# EAGLE design LightLabBackPanel (EAGLE 7.6.0)
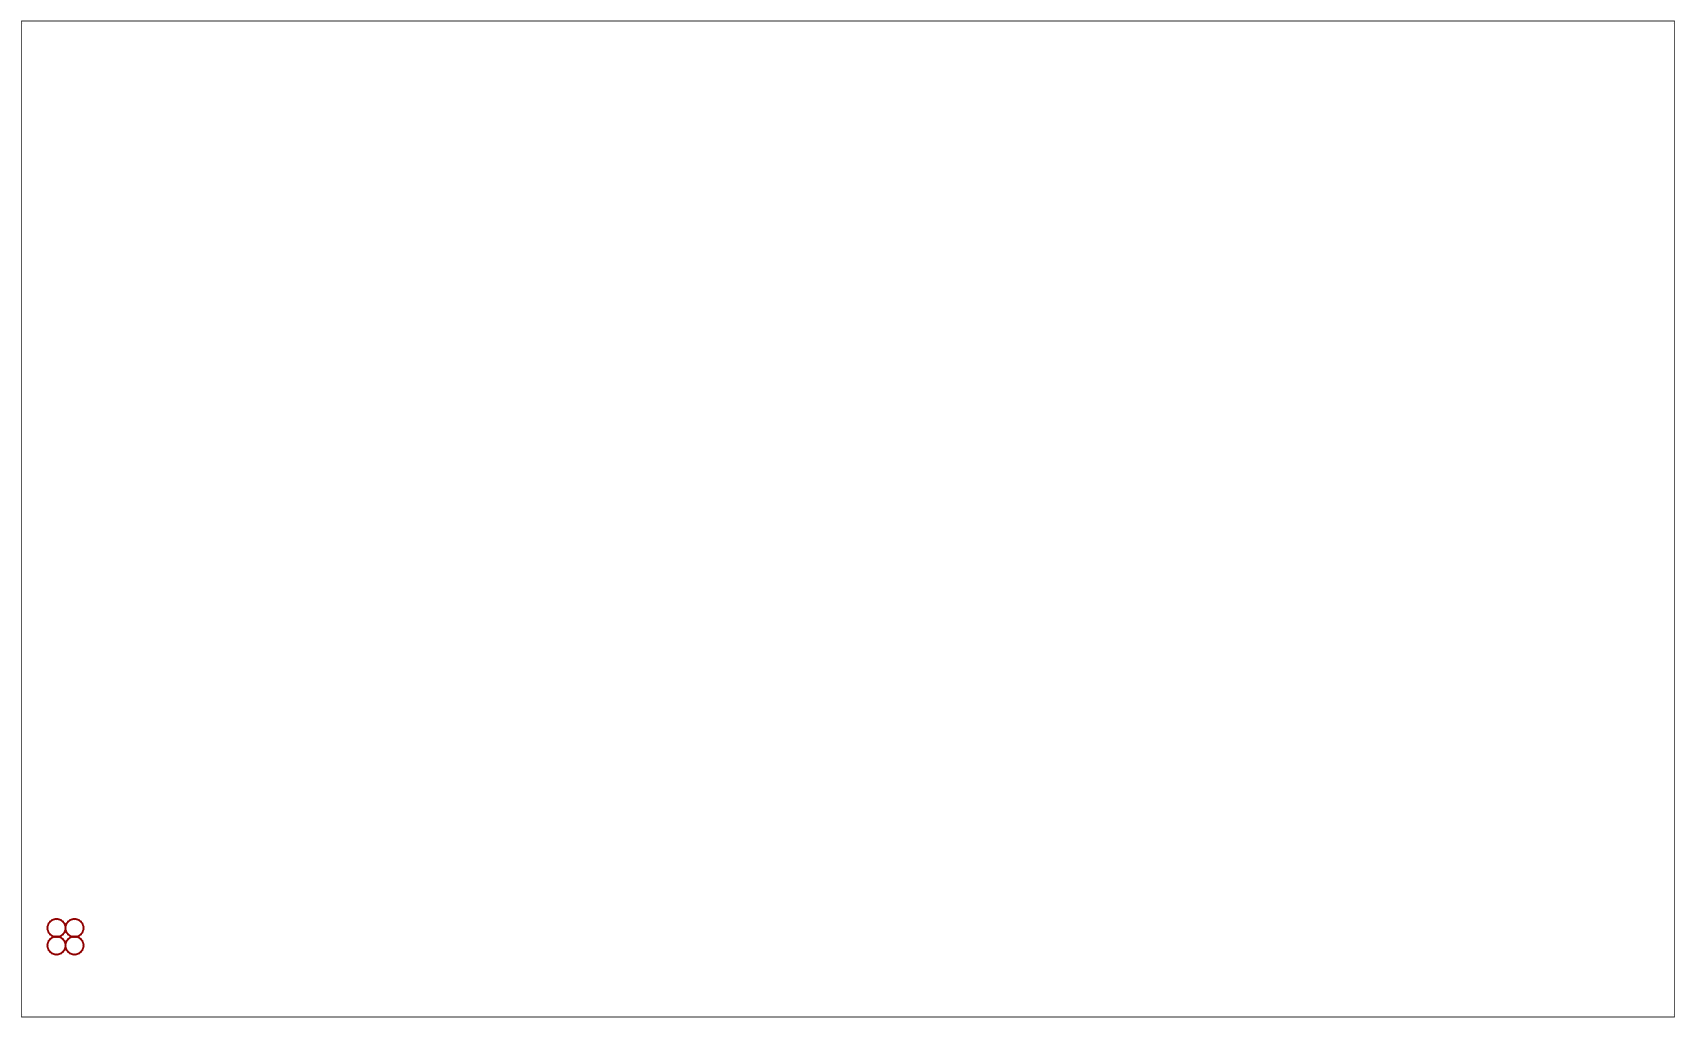
[diagram p0: schematic, sheet 1]

## Parts
JP11  STAND-OFF  [STAND-OFF]
JP13  STAND-OFF  [STAND-OFF]
JP14  STAND-OFF  [STAND-OFF]
JP15  STAND-OFF  [STAND-OFF]

## Library data of the parts
JP11 JP13-JP15 = SparkFun:STAND-OFF: Stand Off This is the mechanical footprint for a #4 phillips button head screw. Use the keepout ring to avoid running the screw head into surrounding components. SKU : PRT-00447

## Net classes
1 power: width 1.626 mm, clearance 0.406 mm

## Board
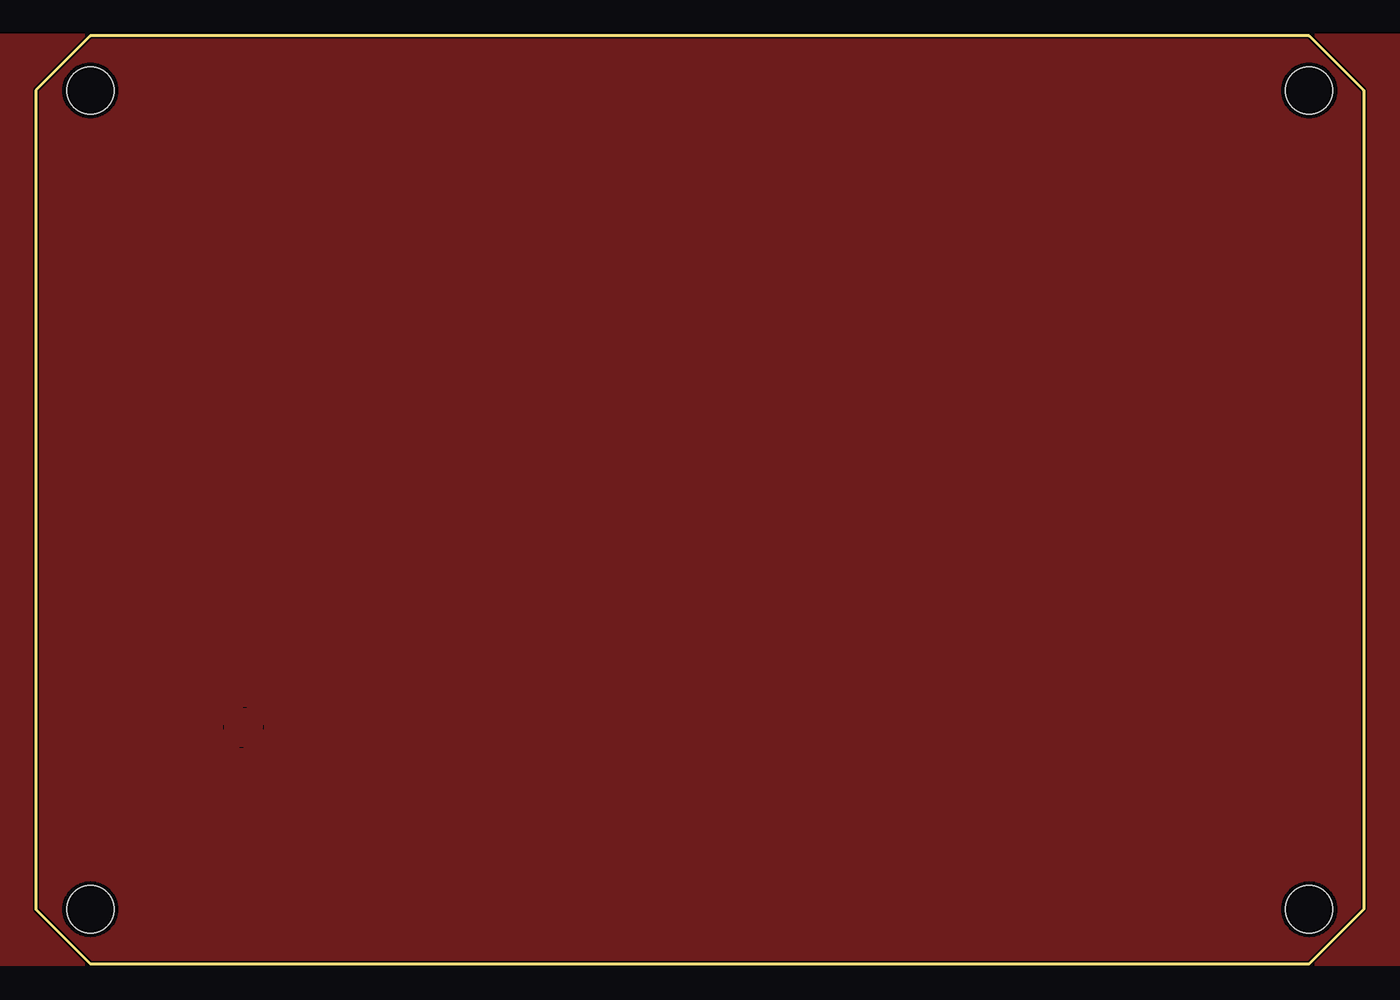
[diagram p1: board, top side]
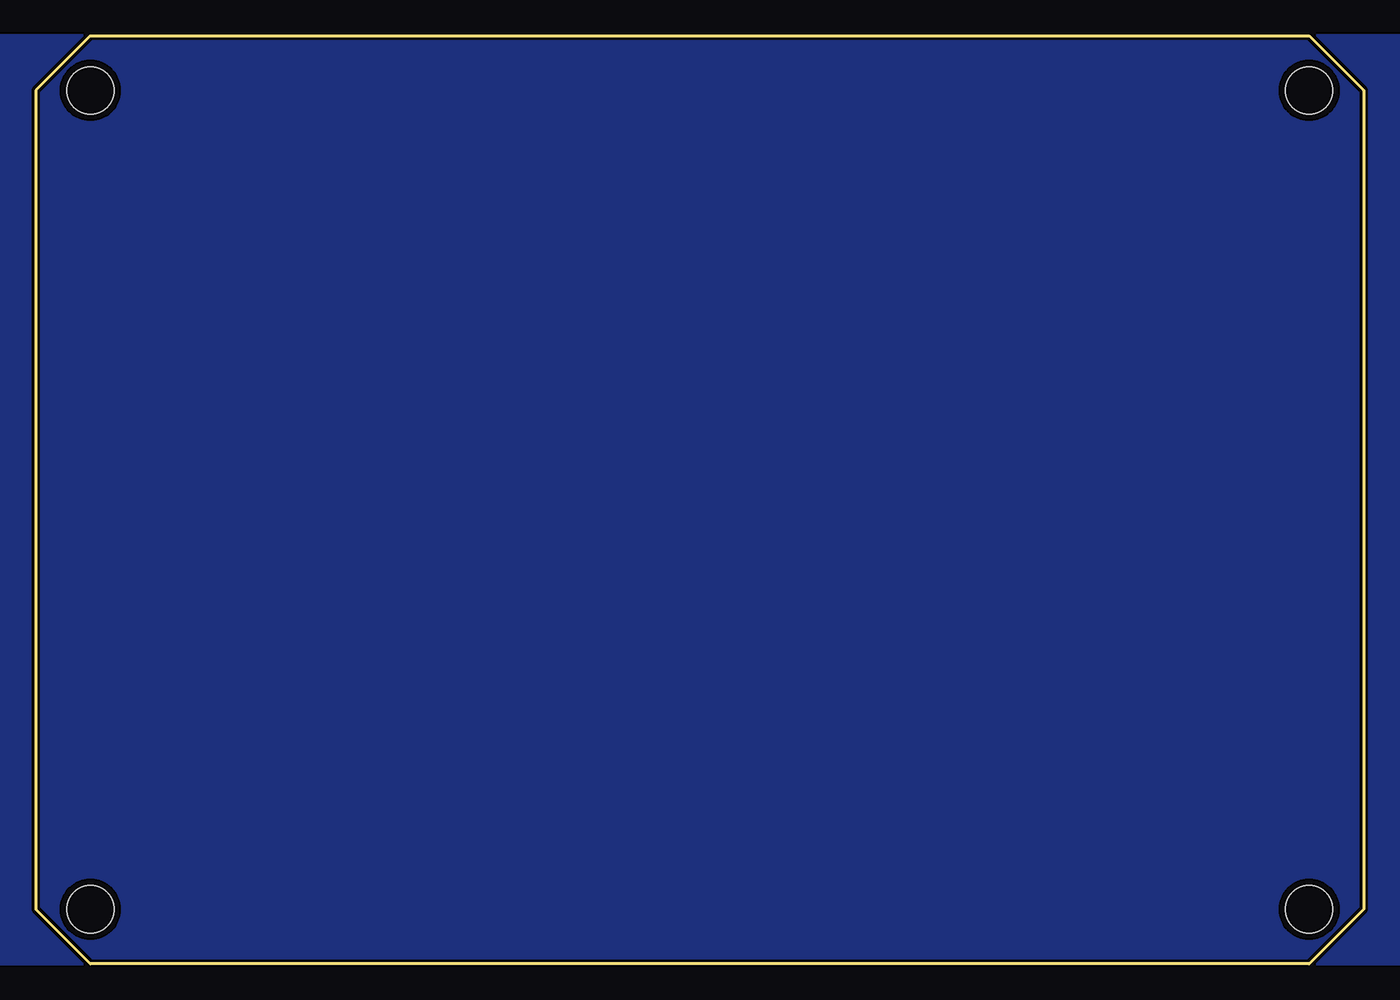
[diagram p2: board, bottom side, seen from below]

Size 92.71 x 64.77 mm. Coordinates in mm from the lower left corner, seen from the top.
Outline: 88.9,64.77 3.81,64.77 0,60.96 0,3.81 3.81,0 88.9,0 92.71,3.81 92.71,60.96 88.9,64.77
Copper layers (1*16): Top 0.035mm / dielectric 1.5mm / Bottom 0.035mm
Design rules "SparkFun-2-layer-FAB-LIMIT *": minimum track width 4mil, minimum drill 6mil, track to track 3mil, track to pad 3mil, pad to pad 3mil, via to via 3mil, smd to smd 3mil, copper to edge 4mil, drill to drill 4mil, minimum pad ring 5mil, minimum via ring 5mil, stop-mask expansion 4mil, vias tented up to drill 25mil, thermal gap 10mil
tRestrict: 4 lines

### Footprints (pad centres in the part's own frame; a part is rotated, then mirrored left to right if it is on the bottom)
STAND-OFF = hole 3.302: 0,0

### Placement (x,y rotation side)
JP11  88.9,60.96 0 top
JP13  3.81,60.96 0 top
JP14  88.9,3.81 0 top
JP15  3.81,3.81 0 top

### Tracks (layer width: path | path; a pad name or v marks a point on that pad's centre or on a via)
GND
  pour Bottom (isolate 0.203, rank 2): -2.54,64.77 95.25,64.77 95.25,0 -2.54,0
  pour Top (rank 2): -3.81,64.77 -3.81,0 96.52,0 96.52,64.77